# Altium schematic sheet sensor.SchDoc
size A4
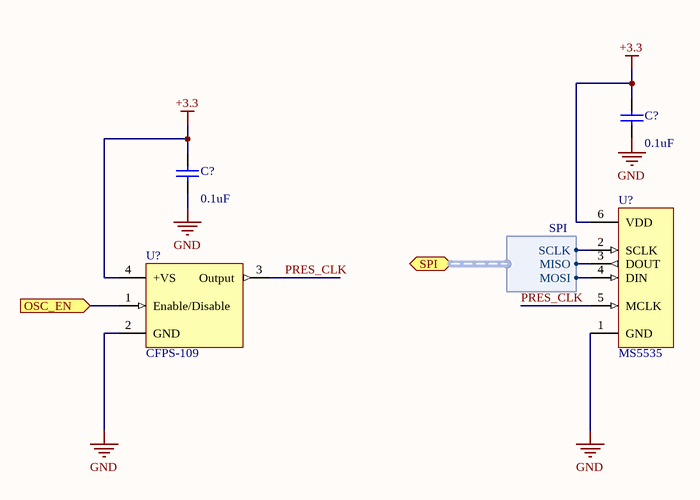
[diagram p0: sensor.SchDoc]

## Parts
(Parts that share a designator on the sheet are numbered #1, #2 ... from top to bottom, then left to right.)
C?#1  value 0.1uF  [RAD-0.3]  (hidden comment: Cap)
C?#2  value 0.1uF  [RAD-0.3]  (hidden comment: Cap)
U?#1  MS5535  [MS5535]
U?#2  CFPS-109

## Ports
OSC_EN (in), SPI (harness SPI)

## Harnesses
SPI: SCLK, MISO, MOSI

## Nets
+3.3: C?#1.2 C?#2.2 U?#1.6(VDD) U?#2.4(+VS)
GND: C?#1.1 C?#2.1 U?#1.1(GND) U?#2.2(GND)
OSC_EN: U?#2.1(Enable/Disable) ; port OSC_EN
PRES_CLK: U?#1.5(MCLK) U?#2.3(Output)
NetU?#1_2: U?#1.2(SCLK) ; port SPI.SCLK
NetU?#1_3: U?#1.3(DOUT) ; port SPI.MISO
NetU?#1_4: U?#1.4(DIN) ; port SPI.MOSI

## Library data of the parts
C?#1 C?#2 = Cap: Capacitor; Published: 8-Jun-2000; LatestRevisionDate: 17-Jul-2002; LatestRevisionNote: Re-released for DXP Platform.; PackageReference: RAD-0.3; Publisher: Altium Limited
U?#1 = MS5535: SENSOR PRESURE 14 BAR 16BIT; digikey: 223-1101-1-ND
U?#2 = CFPS-109: farnell: 1674695